# EAGLE schematic LATCH (EAGLE 9.3.1)
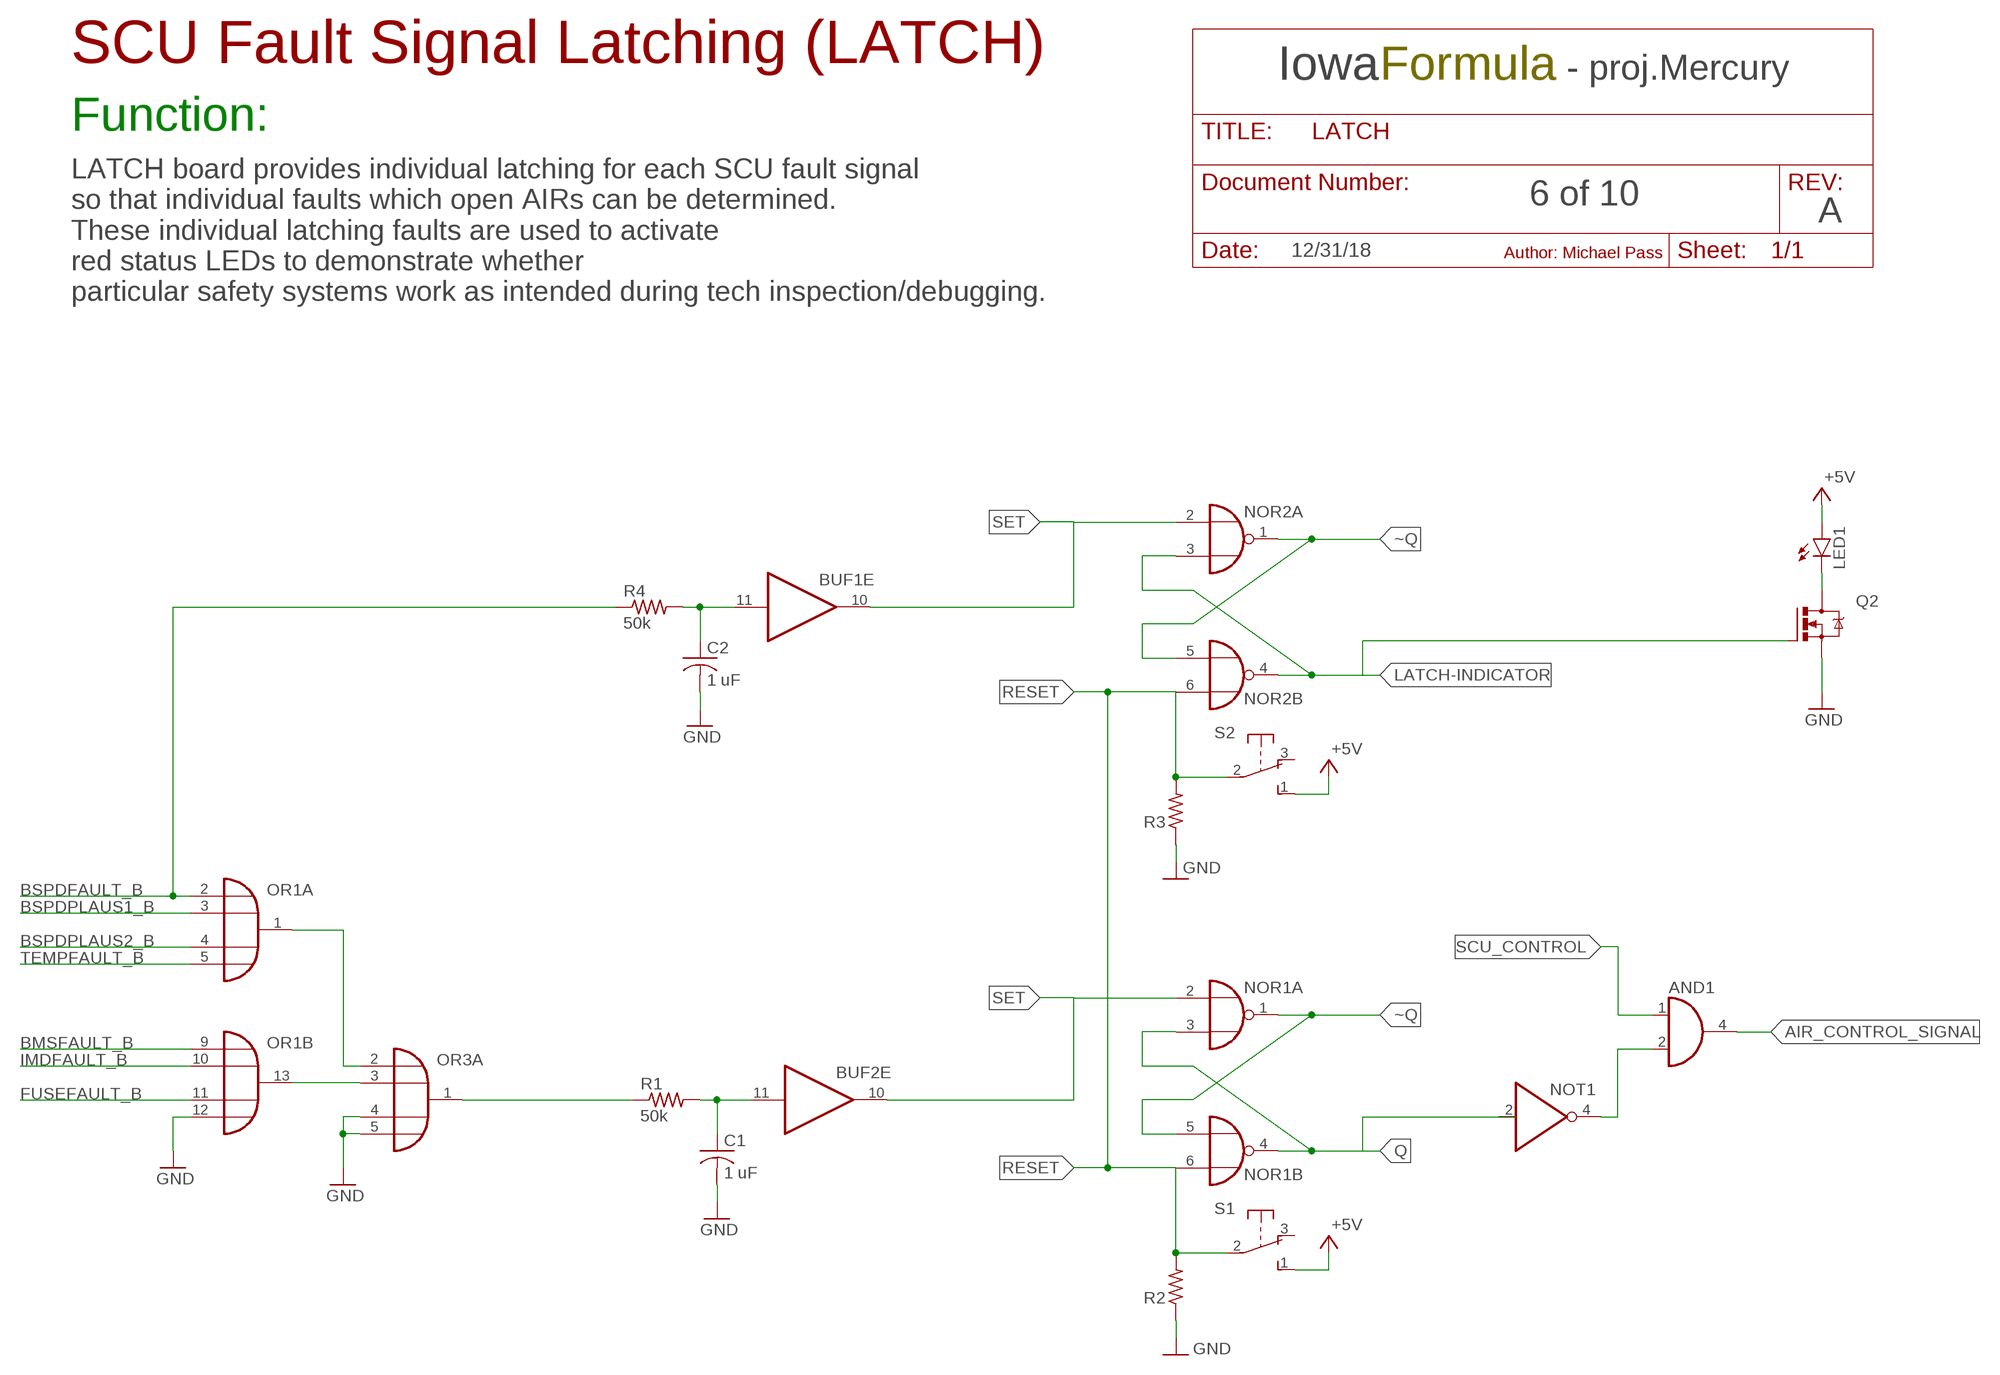
[diagram p0: schematic, sheet 1]

## Parts
AND1  74AHCT1G08DCK  [SC70-5]
BUF1  7407D  [SO14]
BUF2  7407D  [SO14]
C1  1 uF  C-USC0805  [C0805]
C2  1 uF  C-USC0805  [C0805]
LED1  LED10MM  [LED10MM]
NOR1  74LS33D  [SO14]
NOR2  74LS33D  [SO14]
NOT1  74LVC1G06DCK  [SC70-5]
OR1  4072D  [SO14]
OR3  4072D  [SO14]
Q2  IRLZ44Z  [TO220BH]
R1  50k  R-US_R0805  [R0805]
R2  R-US_R0805  [R0805]
R3  R-US_R0805  [R0805]
R4  50k  R-US_R0805  [R0805]
S1  9077-1  [9077-1]
S2  9077-1  [9077-1]

## Nets
+5V: LED1.A S1.1(S) S2.1(S)
AIR_CONTROL_SIGNAL: AND1.4(O)
BMSFAULT_B: OR1.9(B:I0)
BSPDFAULT_B: OR1.2(A:I0) R4.1
BSPDPLAUS1_B: OR1.3(A:I1)
BSPDPLAUS2_B: OR1.4(A:I2)
FUSEFAULT_B: OR1.11(B:I2)
GND: C1.2 C2.2 OR1.12(B:I3) Q2.S R2.1 R3.1
IMDFAULT_B: OR1.10(B:I1)
LATCH-INDICATOR: NOR2.3(A:I1) NOR2.4(B:O) Q2.G
N$1: OR1.1(A:O) OR3.2(A:I0)
N$2: OR1.13(B:O) OR3.3(A:I1)
N$3: OR3.4(A:I2) OR3.5(A:I3) ; supply symbol labelled GND
N$4: LED1.K(C) Q2.D
N$5: OR3.1(A:O) R1.1
N$6: BUF2.11(E:I) C1.1 R1.2
N$7: BUF1.11(E:I) C2.1 R4.2
N$8: AND1.2(I1) NOT1.4(O)
Q: NOR1.3(A:I1) NOR1.4(B:O) NOT1.2(I)
RESET: NOR1.6(B:I1) NOR2.6(B:I1) R2.2 R3.2 S1.2(P) S2.2(P)
SCU_CONTROL: AND1.1(I0)
SET: BUF1.10(E:O) BUF2.10(E:O) NOR1.2(A:I0) NOR2.2(A:I0)
TEMPFAULT_B: OR1.5(A:I3)
~Q: NOR1.1(A:O) NOR1.5(B:I0) NOR2.1(A:O) NOR2.5(B:I0)
Unconnected: BUF1.1(A:I) BUF1.2(A:O) BUF1.3(B:I) BUF1.4(B:O) BUF1.5(C:I) BUF1.6(C:O) BUF1.8(D:O) BUF1.9(D:I) BUF1.12(F:O) BUF1.13(F:I) BUF2.1(A:I) BUF2.2(A:O) BUF2.3(B:I) BUF2.4(B:O) BUF2.5(C:I) BUF2.6(C:O) BUF2.8(D:O) BUF2.9(D:I) BUF2.12(F:O) BUF2.13(F:I) NOR1.8(C:I0) NOR1.9(C:I1) NOR1.10(C:O) NOR1.11(D:I0) NOR1.12(D:I1) NOR1.13(D:O) NOR2.8(C:I0) NOR2.9(C:I1) NOR2.10(C:O) NOR2.11(D:I0) NOR2.12(D:I1) NOR2.13(D:O) OR3.9(B:I0) OR3.10(B:I1) OR3.11(B:I2) OR3.12(B:I3) OR3.13(B:O) S1.3(O) S2.3(O)

## Notes on the sheet
- SCU Fault Signal Latching (LATCH)
- Iowa | Formula | - proj.Mercury
- Function:
- 6 of 10
- A
- 12/31/18 | Author: Michael Pass
- LATCH board provides individual latching for each SCU fault signal
  so that individual faults which open AIRs can be determined.
  These individual latching faults are used to activate
  red status LEDs to demonstrate whether 
  particular safety systems work as intended during tech inspection/debugging.

## Power pins joined to a net without a drawn wire
GND: AND1.3(GND) BUF1.7(P:GND) BUF2.7(P:GND) NOR1.7(P:GND) NOR2.7(P:GND) NOT1.3(GND)
VCC: AND1.5(VCC) BUF1.14(P:VCC) BUF2.14(P:VCC) NOR1.14(P:VCC) NOR2.14(P:VCC) NOT1.5(VCC)
VDD: OR1.14(P:VDD) OR3.14(P:VDD)
VSS: OR1.7(P:VSS) OR3.7(P:VSS)

## Library data of the parts
AND1 = 74xx-little-de:74*1G08: 2-input AND gate
BUF1 BUF2 = 74xx-eu:74*07: Hex BUFFER, open collector high-voltage output
C1 C2 = rcl:C-US: CAPACITOR, American symbol; SPICEPREFIX: C
LED1 = led:LED: LED OSRAM: - CHIPLED LG R971, LG N971, LY N971, LG Q971, LY Q971, LO R971, LY R971 LH N974, LH R974 LS Q976, LO Q976, LY Q976 LO Q996 - Hyper CHIPLED LW Q18S LB Q993, LB Q99A, LB R99A - SideLED LS A670, LO A670, LY A670, LG A670, LP A670 LB A673, LV A673, LT A673, LW A673 LH A674 LY A675 LS A676, LA A676, LO A676, LY A676, LW A676 LS A679, LY A679, LG A679 - Hyper Micro SIDELED® LS Y876, LA Y876, LO Y876, LY Y876 LT Y87S - SmartLED LW L88C, LW L88S LB L89C, LB L89S, LG L890 LS L89K, LO L89K, LY L89K LS L896, LA L896, LO L896, LY L896 - TOPLED LS T670, LO T670, LY T670, LG T670, LP T670 LSG T670, LSP T670, LSY T670, LOP T670, LYG T670 LG T671, LOG T671, LSG T671 LB T673, LV T673, LT T673, LW T673 LH T674 LS T676, LA T676, LO T676, LY T676, LB T676, LH T676, LSB T676, LW T676 LB T67C, LV T67C, LT T67C, LS T67K, LO T67K, LY T67K, LW E67C LS E67B, LA E67B, LO E67B, LY E67B, LB E67C, LV E67C, LT E67C LW T67C LS T679, LY T679, LG T679 LS T770, LO T770, LY T770, LG T770, LP T770 LB T773, LV T773, LT T773, LW T773 LH T774 LS E675, LA E675, LY E675, LS T675 LS T776, LA T776, LO T776, LY T776, LB T776 LHGB T686 LT T68C, LB T68C - Hyper Mini TOPLED® LB M676 - Mini TOPLED Santana® LG M470 LS M47K, LO M47K, LY M47K Source: http://www.osram.convergy.de LUXEON: - LUMILED® LXK2-PW12-R00, LXK2-PW12-S00, LXK2-PW14-U00, LXK2-PW14-V00 LXK2-PM12-R00, LXK2-PM12-S00, LXK2-PM14-U00 LXK2-PE12-Q00, LXK2-PE12-R00, LXK2-PE12-S00, LXK2-PE14-T00, LXK2-PE14-U00 LXK2-PB12-K00, LXK2-PB12-L00, LXK2-PB12-M00, LXK2-PB14-N00, LXK2-PB14-P00, LXK2-PB14-Q00 LXK2-PR12-L00, LXK2-PR12-M00, LXK2-PR14-Q00, LXK2-PR14-R00 LXK2-PD12-Q00, LXK2-PD12-R00, LXK2-PD12-S00 LXK2-PH12-R00, LXK2-PH12-S00 LXK2-PL12-P00, LXK2-PL12-Q00, LXK2-PL12-R00 Source: www.luxeon.com KINGBRIGHT: KA-3528ASYC Source: www.kingbright.com
NOR1 NOR2 = 74xx-eu:74*33: Quad 2-input NOR buffer, open collector
NOT1 = 74xx-little-de:74*1G06: Single Inverter Buffer/Driver With Open-Drain Output
OR1 OR3 = 40xx:4072: Dual 4-input OR
Q2 = transistor-power:IRLZ44Z: N-Channel HEXFET® Power MOSFET Logic Level AUTOMOTIVE MOSFET Source: http://www.irf.com/product-info/datasheets/data/irlz44zpbf.pdf
R1-R4 = rcl:R-US_: RESISTOR, American symbol; SPICEPREFIX: R
S1 S2 = switch-misc:9077-1: MARQUARDT SWITCH 9077.0100 Distributor: Buerklin <https://www.buerklin.com/default.asp?event=ShowArtikel%2812G2820%29&l=d&jump=ArtNr_12G2820>